# EAGLE design aufsatz_v2.2_dmx (EAGLE 6.5.0)
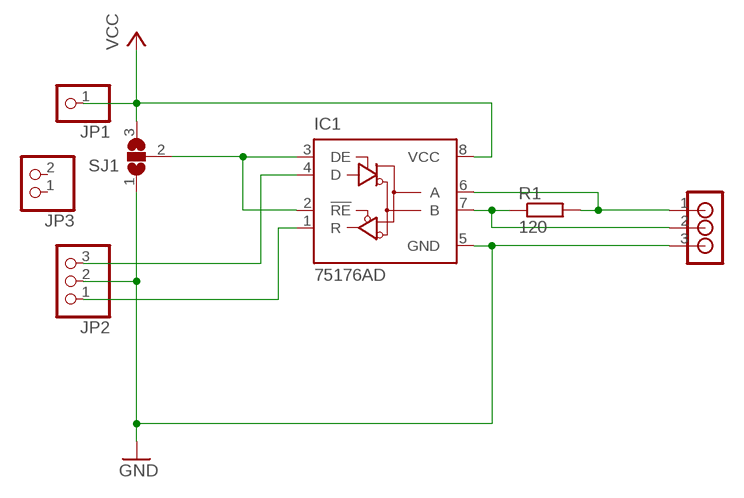
[diagram p0: schematic, sheet 1]

## Parts
IC1  75176AD  [D_R-PDSO-G8]
JP1  PINHD-1X1  [1X01]
JP2  PINHD-1X3  [1X03]
JP3  PINHD-1X2  [1X02]
R1  120  R-EU_R0805  [R0805]
SJ1  SJ2W  [SJ_2]
U$1  RIACON_59_3  [RIACON_59_3]

## Nets
A: IC1.6(A) R1.2 U$1.1
B: IC1.7(B) R1.1 U$1.2
D: IC1.4(D) JP2.3
GND: IC1.5(GND) JP2.2 SJ1.1 U$1.3
N$4: IC1.2(!RE) IC1.3(DE) SJ1.2
R: IC1.1(R) JP2.1
VCC: IC1.8(VCC) JP1.1 SJ1.3
Unconnected: JP3.1 JP3.2

## Library data of the parts
IC1 = 751xx:75176A: DIFFERENTIAL BUS TRANSCEIVER Source: http://focus.ti.com/lit/ds/symlink/sn75176a.pdf
JP1 = pinhead:PINHD-1X1: PIN HEADER
JP2 = pinhead:PINHD-1X3: PIN HEADER
JP3 = pinhead:PINHD-1X2: PIN HEADER
R1 = rcl:R-EU_: RESISTOR, European symbol
SJ1 = jumper:SJ2W: SMD solder JUMPER
U$1 = n39:RIACON_59_3: RIACON Anschlussklemme (AKL) Typ 59 Rastermaß 3,5 mm; REICHELT: AKL 059-03

## Board
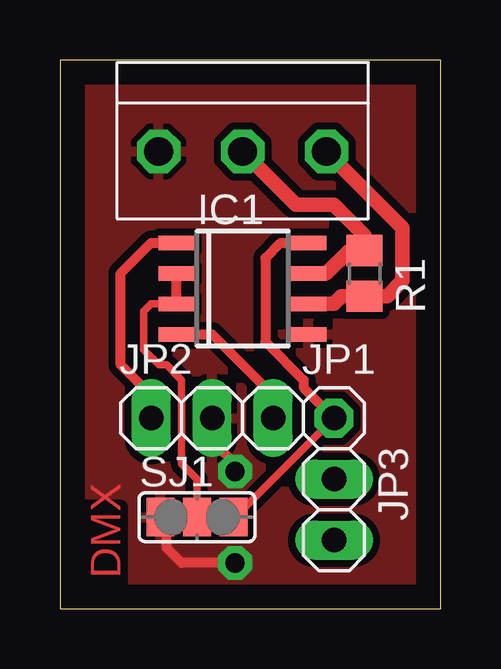
[diagram p1: board, top side]
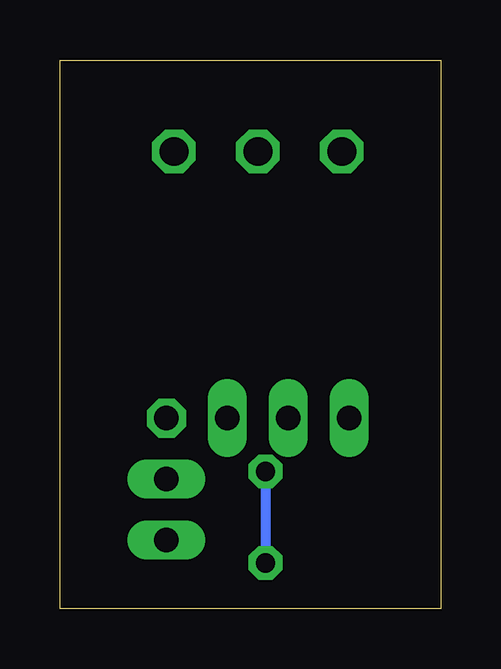
[diagram p2: board, bottom side, seen from below]

Size 15.88 x 22.86 mm. Coordinates in mm from the lower left corner, seen from the top.
Outline: 0,0 15.88,0 15.88,22.86 0,22.86 0,0
Copper layers (1*16): Top 0.035mm / dielectric 1.5mm / Bottom 0.035mm
Design rules "default *": minimum track width 12mil, minimum drill 0.8mm, track to track 12mil, track to pad 12mil, pad to pad 12mil, via to via 12mil, smd to smd 8mil, copper to edge 40mil, drill to drill 8mil, minimum pad ring 12mil, minimum via ring 12mil, stop-mask expansion 4mil, vias tented up to drill 0mil, thermal gap 10mil

### Footprints (pad centres in the part's own frame; a part is rotated, then mirrored left to right if it is on the bottom)
D_R-PDSO-G8 = smd 0.6 x 1.5: 1 -1.905,-2.75; 2 -0.635,-2.75; 3 0.635,-2.75; 4 1.905,-2.75; 5 1.905,2.75; 6 0.635,2.75; 7 -0.635,2.75; 8 -1.905,2.75
1X01 = drill 1.016 octagon: 1 0,0
1X03 = drill 1.016 long: 1 -2.54,0; 2 0,0; 3 2.54,0
1X02 = drill 1.016 long: 1 -1.27,0; 2 1.27,0
R0805 = smd 1.3 x 1.5: 1 -0.95,0; 2 0.95,0
SJ_2 = smd 1.168 x 1.6: 1 -1.524,0; 2 0,0; 3 1.524,0
RIACON_59_3 = drill 1.2 octagon: 1 -3.5,0; 2 0,0; 3 3.5,0

### Placement (x,y rotation side)
IC1  7.62,13.34 270 top
JP1  11.43,7.94 0 top
JP2  6.35,7.94 0 top
JP3  11.43,4.13 270 top
R1  12.7,13.97 270 top
SJ1  5.71,3.81 0 top
U$1  7.62,19.05 180 top

### Tracks (layer width: path | path; a pad name or v marks a point on that pad's centre or on a via)
A
  Top 0.61: U$1.1 14.29,15.88 14.29,13.65 13.65,13.02 R1.2 | R1.2 | R1.2 11.75,13.02 11.43,12.7 IC1.6
B
  Top 0.61: IC1.7 11.11,13.97 12.06,14.92 R1.1 12.7,15.56 11.43,16.83 9.84,16.83 U$1.2
D
  Top 0.406: IC1.4 6.35,11.43 8.89,8.89 JP2.3
GND  (via drill 0.8)
  Top 0.406: IC1.5 10.79,11.43 | JP2.2 6.35,6.99 7.3,6.03 v7.3,5.71 | v7.3,1.91 5.08,1.91 4.45,2.54 4.45,3.56 SJ1.1
  Bottom 0.406: v7.3,5.71 v7.3,1.91
  pour Top: 0,22.86 15.88,22.86 15.88,0 0,0
N$4
  Top 0.305: SJ1.2 5.71,5.4 5.08,6.03 5.08,9.53 4.45,10.16 4.13,10.16 3.49,10.79 3.49,12.38 3.81,12.7 IC1.3
  Top 0.406: IC1.3 IC1.2
R
  Top 0.406: JP2.1 3.81,8.89 2.54,10.16 2.54,13.97 3.81,15.24 IC1.1
VCC
  Top 0.305: JP1.1 7.3,3.81
  Top 0.406: 7.3,3.81 SJ1.3 | IC1.8 9.21,15.24 8.57,14.61 8.57,11.11 10.16,9.53 10.16,9.21 JP1.1

### Text on the board
Top: DMX